# Altium project class-sensor.PrjPcb (part 1 of 2)
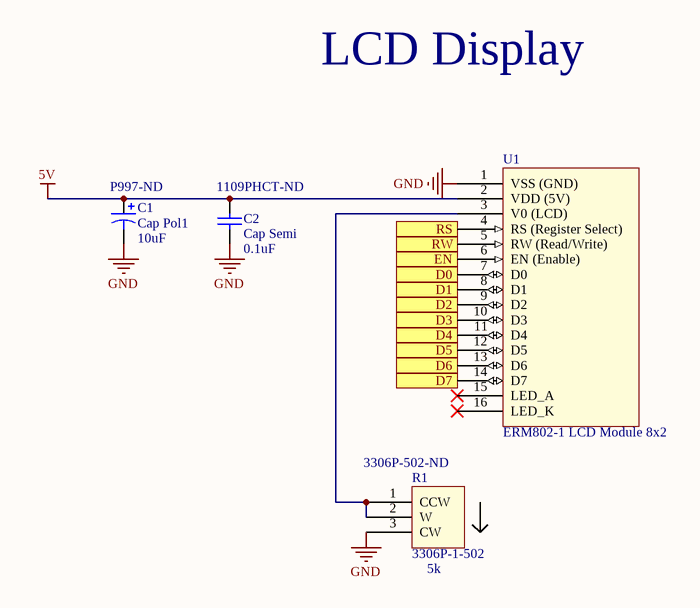
[diagram p0: sensor-1.SchDoc]
6 sheets, 52 parts. Net scope: global (net labels, ports and power ports of the same name join across sheets).
Board file: class-sensor.PcbDoc
Sheets:
  sensor-1.SchDoc
  sensor-2.SchDoc
  sensor-3.SchDoc
  sensor-4.SchDoc
  sensor-5.SchDoc
  sensor-6.SchDoc

## Sheet sensor-1.SchDoc
size Letter

### Parts
C1  Cap Pol1  value 10uF  Supplier Part Number 1: P997-ND  [ECE-A1HKS100]
C2  Cap Semi  value 0.1uF  Supplier Part Number 1: 1109PHCT-ND  [A104K15X7RF5TAA]
R1  3306P-1-502  Supplier Part Number 1: 3306P-502-ND  [3306P-1-502]
U1  ERM802-1 LCD Module 8x2  [ERM802-1]

### Ports
D0, D1, D2, D3, D4, D5, D6, D7, EN, RS, RW

### Nets
5V: C1.1 C2.2 U1.2(VDD_(5V))
GND: C1.2 C2.1 R1.3(CW) U1.1(VSS_(GND))
NetR1_1: R1.1(CCW) R1.2(W) U1.3(V0_(LCD))
NetU1_4: U1.4(RS_(Register_Select)) ; port RS
NetU1_5: U1.5(RW_(Read/Write)) ; port RW
NetU1_6: U1.6(EN_(Enable)) ; port EN
NetU1_7: U1.7(D0) ; port D0
NetU1_8: U1.8(D1) ; port D1
NetU1_9: U1.9(D2) ; port D2
NetU1_10: U1.10(D3) ; port D3
NetU1_11: U1.11(D4) ; port D4
NetU1_12: U1.12(D5) ; port D5
NetU1_13: U1.13(D6) ; port D6
NetU1_14: U1.14(D7) ; port D7

Not connected (* = marked no-connect by the designer): U1 15(LED_A)* 16(LED_K)*

### Notes on the sheet
- LCD Display
- (near R1) 5k

### Library data of the parts
C1 = Cap Pol1: Polarized Capacitor (Radial); Manufacturer: Panasonic; Ripple Current: 35mA; Tolerance: 20%; Voltage Rating: 50V; Polarity: Polar; Life (Hours): 1000Hour; Leakage Current: 3A; Lead Diameter: 0.45mm; Published: 8-Jun-2000; LatestRevisionDate: 17-Jul-2002; LatestRevisionNote: Re-released for DXP Platform.; PackageReference: RB7.6-15; Publisher: Altium Limited; PackageDescription: Polarized Capacitor (Radial); 2 Leads; Supplier 1: Digi-Key; Manufacturer Part Number: ECE-A1HKS100; Stock 1: 132836; Pricing 1: 1=0.10000, 10=0.03000 (USD); RoHS: Yes; Mount: Through Hole,PCB; Case/Package: Radial; Number of Pins: 2; Weight: 0.01lb; Min Operating Temperature: -40°C; Max Operating Temperature: 85°C; Package Quantity: 200; Capacitance: 10uF; Packaging: Bulk; Voltage Rating (DC): 50V; Ripple Current (AC): 35mA; Termination: Radial; Voltage: 50V; Diameter: 6.3mm; Length: 5mm; Height: 5mm; Lead Pitch: 2.5mm; Width: 0.5inch; Height - Seated (Max): 0.197inch; Radiation Hardening: No; Lead Free: Lead Free; REACH SVHC: No SVHC; ComponentLink1URL: https://datasheet.ciiva.com/11778/0900766b800274c4-11778985.pdf?src-supplier=RSComponents; ComponentLink1Description: https://datasheet.ciiva.com/11778/0900766b800274c4-11778985.pdf?src-supplier=RSComponents; ComponentLink2URL: https://datasheet.ciiva.com/17536/aba0000ce15-17536597.pdf?src-supplier=Avnet+Europe; ComponentLink2Description: https://datasheet.ciiva.com/17536/aba0000ce15-17536597.pdf?src-supplier=Avnet+Europe; ComponentLink3URL: https://datasheet.ciiva.com/14594/70067878-14594328.pdf?src-supplier=Allied+Electronics; ComponentLink3Description: https://datasheet.ciiva.com/14594/70067878-14594328.pdf?src-supplier=Allied+Electronics; ComponentLink4URL: https://datasheet.ciiva.com/16205/aba0000ce15-16205737.pdf?src-supplier=Future+Electronics; ComponentLink4Description: https://datasheet.ciiva.com/16205/aba0000ce15-16205737.pdf?src-supplier=Future+Electronics; ComponentLink5URL: https://datasheet.ciiva.com/24025/a-e-461514-24025641.pdf?src-supplier=Mouser; ComponentLink5Description: https://datasheet.ciiva.com/24025/a-e-461514-24025641.pdf?src-supplier=Mouser; ComponentLink6URL: https://datasheet.ciiva.com/43459/1339471-43459545.pdf?src-supplier=Farnell; ComponentLink6Description: https://datasheet.ciiva.com/43459/1339471-43459545.pdf?src-supplier=Farnell; ComponentLink7URL: https://datasheet.ciiva.com/15166/getdatasheetpartid-169217-15166123.pdf?src-supplier=Verical; ComponentLink7Description: https://datasheet.ciiva.com/15166/getdatasheetpartid-169217-15166123.pdf?src-supplier=Verical; ComponentLink8URL: https://datasheet.ciiva.com/46397/1339471-46397117.pdf?src-supplier=Element14; ComponentLink8Description: https://datasheet.ciiva.com/46397/1339471-46397117.pdf?src-supplier=Element14; ComponentLink9URL: https://datasheet.ciiva.com/2983/aba0000ce15-2983886.pdf?src-supplier=Avnet; ComponentLink9Description: https://datasheet.ciiva.com/2983/aba0000ce15-2983886.pdf?src-supplier=Avnet
C2 = Cap Semi: Capacitor (Semiconductor SIM Model); Manufacturer: Vishay BCcomponents; Capacitance: 100nF; Voltage Rating: 50V; Tolerance: 10%; Dielectric: X7R; Lead Length: 24.3mm; Lead Diameter: 0.5mm; Published: 8-Jun-2000; LatestRevisionDate: 29-May-2009; LatestRevisionNote: IPC-7351 Footprint Added.; PackageReference: C1206; Publisher: Altium Limited; PackageDescription: Chip Capacitor; Supplier 1: Digi-Key; Manufacturer Part Number: A104K15X7RF5TAA; Stock 1: 502711; Pricing 1: 1=0.24000, 10=0.16500, 100=0.09350, 500=0.06598, 1000=0.05773, 2500=0.05498 (USD); RoHS: Yes; Mount: Through Hole,PCB,Axial; Case/Package: Dipped; Contact Plating: Tin; Min Operating Temperature: -55°C; Max Operating Temperature: 125°C; Package Quantity: 1; Packaging: Tape and Reel; Voltage Rating (DC): 50V; Termination: Axial; Voltage: 50V; Diameter: 2.5mm; Length: 3.8mm; Radiation Hardening: No; REACH SVHC: Unknown; Lead Free: Lead Free; ComponentLink1URL: https://datasheet.ciiva.com/145/aseries-145936.pdf?src-supplier=Digi-Key; ComponentLink1Description: https://datasheet.ciiva.com/145/aseries-145936.pdf?src-supplier=Digi-Key; ComponentLink2URL: https://datasheet.ciiva.com/5815/1734588-5815375.pdf?src-supplier=Farnell; ComponentLink2Description: https://datasheet.ciiva.com/5815/1734588-5815375.pdf?src-supplier=Farnell; ComponentLink3URL: https://datasheet.ciiva.com/18442/70122957-18442089.pdf?src-supplier=Allied+Electronics; ComponentLink3Description: https://datasheet.ciiva.com/18442/70122957-18442089.pdf?src-supplier=Allied+Electronics; ComponentLink4URL: https://datasheet.ciiva.com/2988/aseries-2988250.pdf?src-supplier=Avnet; ComponentLink4Description: https://datasheet.ciiva.com/2988/aseries-2988250.pdf?src-supplier=Avnet; ComponentLink5URL: https://datasheet.ciiva.com/17444/aseries-17444908.pdf?src-supplier=Avnet+Europe; ComponentLink5Description: https://datasheet.ciiva.com/17444/aseries-17444908.pdf?src-supplier=Avnet+Europe; ComponentLink6URL: https://datasheet.ciiva.com/46418/1796772-46418252.pdf?src-supplier=Element14; ComponentLink6Description: https://datasheet.ciiva.com/46418/1796772-46418252.pdf?src-supplier=Element14; ComponentLink7URL: https://datasheet.ciiva.com/145/aseries-145935.pdf?src-supplier=Digi-Key; ComponentLink7Description: https://datasheet.ciiva.com/145/aseries-145935.pdf?src-supplier=Digi-Key
R1 = 3306P-1-502: TRIMMER 5K OHM 0.2W PC PIN TOP; Manufacturer: Bourns; Resistance: 5kR; Tolerance: 25%; Power Rating: 200mW; Voltage Rating: 100V; Number of Turns: 1; Temperature Coefficient: 250ppm/°C; Pitch: 2.5mm; Supplier 1: Digi-Key; Manufacturer Part Number: 3306P-1-502; Stock 1: 2392; Pricing 1: 1=0.43000, 10=0.40000, 25=0.36000, 50=0.34800, 100=0.33600, 250=0.31200, 500=0.28800, 1000=0.27000, 5000=0.20400 (USD); RoHS: Yes; Mount: Through Hole,PCB; Weight: 360mg; Color: Blue; Contact Plating: Tin; Min Operating Temperature: -25°C; Max Operating Temperature: 100°C; Packaging: Bulk; Package Quantity: 200; Composition: Cermet; Termination: Pin; Taper: Linear; Military Standard: Not; Max Power Dissipation: 200mW; Diameter: 6.81mm; Length: 6.81mm; Height: 7.62mm; Width: 6.81mm; Depth: 8.1mm; Radiation Hardening: No; REACH SVHC: No SVHC; Lead Free: Lead Free; ComponentLink1URL: https://datasheet.ciiva.com/19466/769961-19466616.pdf?src-supplier=Jameco; ComponentLink1Description: https://datasheet.ciiva.com/19466/769961-19466616.pdf?src-supplier=Jameco; ComponentLink2URL: https://datasheet.ciiva.com/11830/0900766b80dbb841-11830858.pdf?src-supplier=RSComponents; ComponentLink2Description: https://datasheet.ciiva.com/11830/0900766b80dbb841-11830858.pdf?src-supplier=RSComponents; ComponentLink3URL: https://datasheet.ciiva.com/29122/447317-da-01-en-trimmer-tht3306p-1-502-5k-0-2w-29122254.pdf?src-supplier=Conrad; ComponentLink3Description: https://datasheet.ciiva.com/29122/447317-da-01-en-trimmer-tht3306p-1-502-5k-0-2w-29122254.pdf?src-supplier=Conrad; ComponentLink4URL: https://datasheet.ciiva.com/2160/3306-2160165.pdf?src-supplier=Digi-Key; ComponentLink4Description: https://datasheet.ciiva.com/2160/3306-2160165.pdf?src-supplier=Digi-Key; ComponentLink5URL: https://datasheet.ciiva.com/20163/67-0600-20163929.pdf?src-supplier=Rapid+Electronics; ComponentLink5Description: https://datasheet.ciiva.com/20163/67-0600-20163929.pdf?src-supplier=Rapid+Electronics; ComponentLink6URL: https://datasheet.ciiva.com/16715/70154382-16715498.pdf?src-supplier=Allied+Electronics; ComponentLink6Description: https://datasheet.ciiva.com/16715/70154382-16715498.pdf?src-supplier=Allied+Electronics; ComponentLink7URL: https://datasheet.ciiva.com/15157/getdatasheetpartid-379572-15157051.pdf?src-supplier=Verical; ComponentLink7Description: https://datasheet.ciiva.com/15157/getdatasheetpartid-379572-15157051.pdf?src-supplier=Verical; ComponentLink8URL: https://datasheet.ciiva.com/1477/1815113-1477453.pdf?src-supplier=Element14; ComponentLink8Description: https://datasheet.ciiva.com/1477/1815113-1477453.pdf?src-supplier=Element14
U1 = ERM802-1

## Sheet sensor-2.SchDoc
size Letter
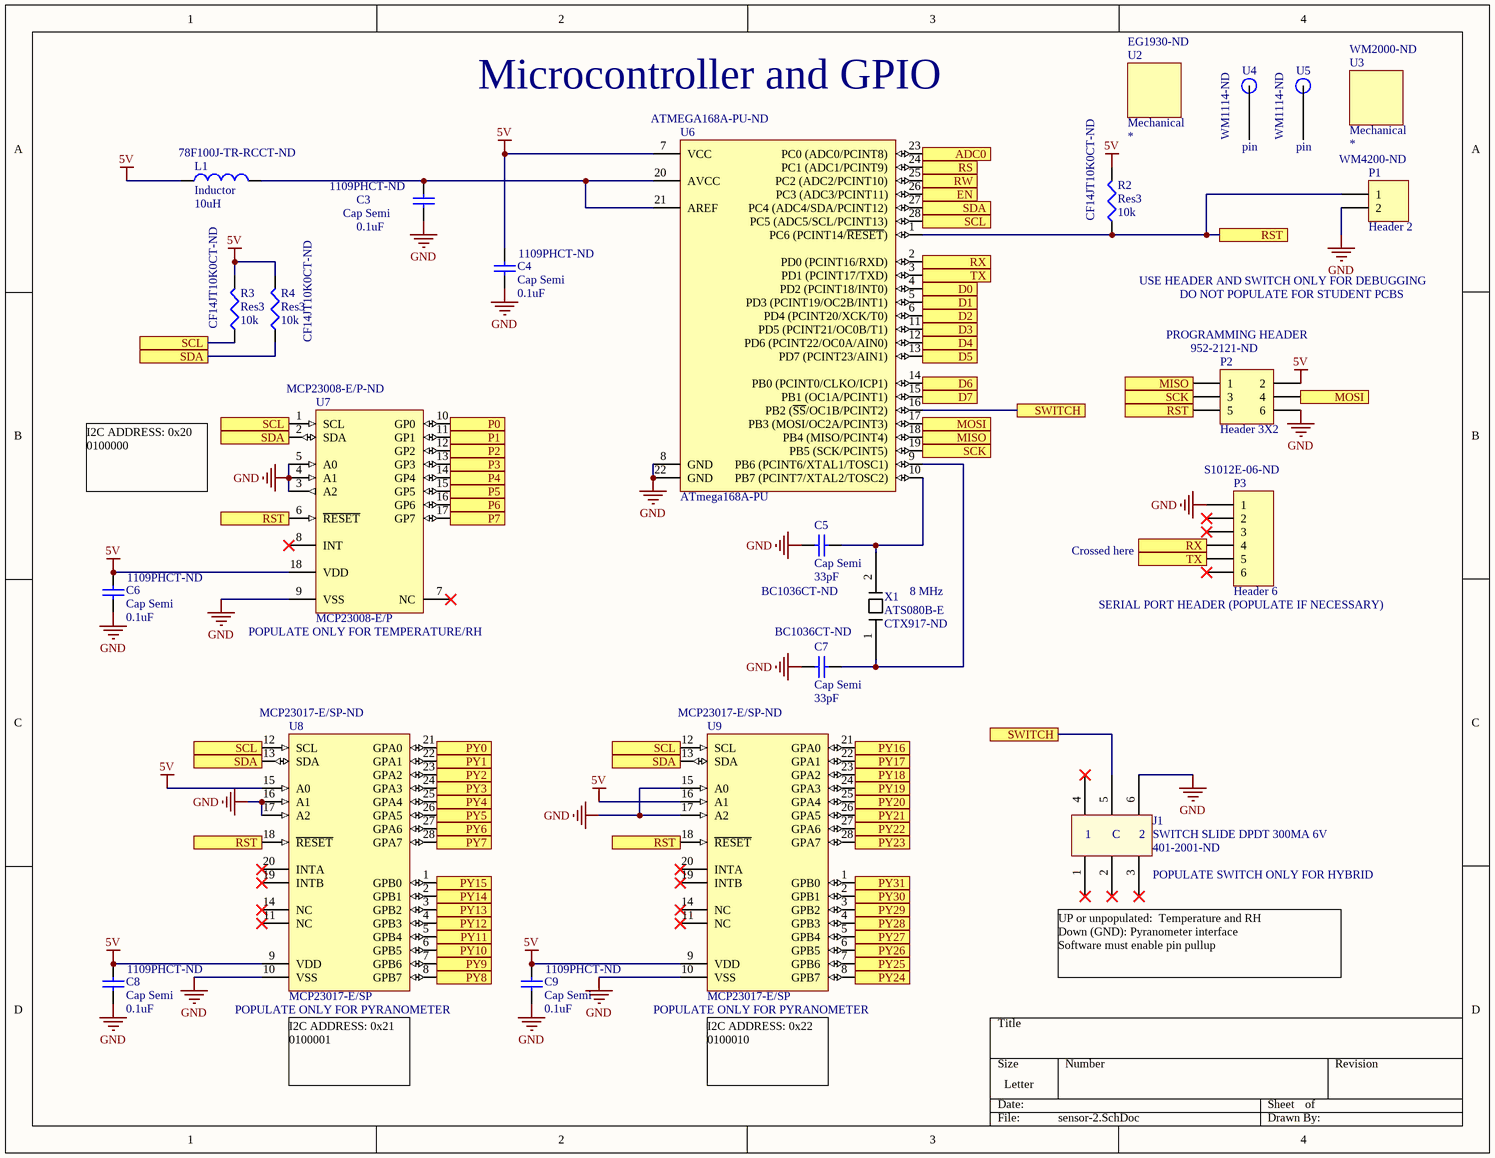
[diagram p1: sensor-2.SchDoc]

### Parts
C3  Cap Semi  value 0.1uF  Supplier Part Number 1: 1109PHCT-ND  [A104K15X7RF5TAA]
C4  Cap Semi  value 0.1uF  Supplier Part Number 1: 1109PHCT-ND  [A104K15X7RF5TAA]
C5  Cap Semi  value 33pF  Supplier Part Number 1: BC1036CT-ND  [K330J15C0GF5TH5]
C6  Cap Semi  value 0.1uF  Supplier Part Number 1: 1109PHCT-ND  [A104K15X7RF5TAA]
C7  Cap Semi  value 33pF  Supplier Part Number 1: BC1036CT-ND  [K330J15C0GF5TH5]
C8  Cap Semi  value 0.1uF  Supplier Part Number 1: 1109PHCT-ND  [A104K15X7RF5TAA]
C9  Cap Semi  value 0.1uF  Supplier Part Number 1: 1109PHCT-ND  [A104K15X7RF5TAA]
J1  SWITCH SLIDE DPDT 300MA 6V  Supplier Part Number 1: 401-2001-ND  [JS202011CQN]
L1  Inductor  value 10uH  Supplier Part Number 1: 78F100J-TR-RCCT-ND  [78F100J-TR-RC]
P1  Header 2  Supplier Part Number 1: WM4200-ND  [HDR1X2]
P2  Header 3X2  Supplier Part Number 1: 952-2121-ND  [HDR2X3]
P3  Header 6  Supplier Part Number 1: S1012E-06-ND  [HDR1X6]
R2  Res3  value 10k  Supplier Part Number 1: CF14JT10K0CT-ND  [CF14JT10K0]
R3  Res3  value 10k  Supplier Part Number 1: CF14JT10K0CT-ND  [CF14JT10K0]
R4  Res3  value 10k  Supplier Part Number 1: CF14JT10K0CT-ND  [CF14JT10K0]
U2  Mechanical  Supplier Part Number 2: EG1930-ND  (mechanical)
U3  Mechanical  Supplier Part Number 2: WM2000-ND  (mechanical)
U4  pin  Supplier Part Number 1: WM1114-ND  (mechanical)
U5  pin  Supplier Part Number 1: WM1114-ND  (mechanical)
U6  ATmega168A-PU  Supplier Part Number 1: ATMEGA168A-PU-ND  [28P3]
U7  MCP23008-E/P  Supplier Part Number 1: MCP23008-E/P-ND  [PDIP300-P18]
U8  MCP23017-E/SP  Supplier Part Number 1: MCP23017-E/SP-ND  [SPDIP300-SP28]
U9  MCP23017-E/SP  Supplier Part Number 1: MCP23017-E/SP-ND  [SPDIP300-SP28]
X1  ATS080B-E  Supplier Part Number 1: CTX917-ND  [ATS080B-E]

### Ports
ADC0, D0, D1, D2, D3, D4, D5, D6, D7, EN, MISO, MOSI, P0, P1, P2, P3, P4, P5, P6, P7, PY0, PY1, PY2, PY3, PY4, PY5, PY6, PY7, PY8, PY9, PY10, PY11, PY12, PY13, PY14, PY15, PY16, PY17, PY18, PY19, PY20, PY21, PY22, PY23, PY24, PY25, PY26, PY27, PY28, PY29, PY30, PY31, RS, RST, RW, RX, SCK, SCL, SDA, SWITCH, TX

### Nets
5V: C4.2 C6.2 C8.2 C9.2 L1.1 P2.2 R2.2 R3.2 R4.2 U6.7(VCC) U7.18(VDD) U8.9(VDD) U8.15(A0) U9.9(VDD) U9.16(A1)
GND: C3.1 C4.1 C5.1 C6.1 C7.1 C8.1 C9.1 J1.6 P1.2 P2.6 P3.1 U6.8(GND) U6.22(GND) U7.3(A2) U7.4(A1) U7.5(A0) U7.9(VSS) U8.10(VSS) U8.16(A1) U8.17(A2) U9.10(VSS) U9.15(A0) U9.17(A2)
NetC3_2: C3.2 L1.2 U6.20(AVCC) U6.21(AREF)
NetC5_2: C5.2 U6.10(PB7_(PCINT7/XTAL2/TOSC2)) X1.2
NetC7_2: C7.2 U6.9(PB6_(PCINT6/XTAL1/TOSC1)) X1.1
NetD4_2: U6.23(PC0_(ADC0/PCINT8)) ; port ADC0
NetJ1_5: J1.5 U6.16(PB2_(~{SS}/OC1B/PCINT2)) ; port SWITCH
NetP1_1: P1.1 P2.5 R2.1 U6.1(PC6_(PCINT14/~{RESET})) U7.6(~{RESET}) U8.18(~{RESET}) U9.18(~{RESET}) ; port RST
NetP2_1: P2.1 U6.18(PB4_(MISO/PCINT4)) ; port MISO
NetP2_3: P2.3 U6.19(PB5_(SCK/PCINT5)) ; port SCK
NetP2_4: P2.4 U6.17(PB3_(MOSI/OC2A/PCINT3)) ; port MOSI
NetP3_4: P3.4 U6.2(PD0_(PCINT16/RXD)) ; port RX
NetP3_5: P3.5 U6.3(PD1_(PCINT17/TXD)) ; port TX
NetP4_1: U8.21(GPA0) ; port PY0
NetP4_3: U8.22(GPA1) ; port PY1
NetP4_5: U8.23(GPA2) ; port PY2
NetP4_7: U8.24(GPA3) ; port PY3
NetP4_9: U8.25(GPA4) ; port PY4
NetP4_11: U8.26(GPA5) ; port PY5
NetP4_13: U8.27(GPA6) ; port PY6
NetP4_15: U8.28(GPA7) ; port PY7
NetP4_17: U8.8(GPB7) ; port PY8
NetP4_19: U8.7(GPB6) ; port PY9
NetP4_21: U8.6(GPB5) ; port PY10
NetP4_23: U8.5(GPB4) ; port PY11
NetP4_25: U8.4(GPB3) ; port PY12
NetP4_27: U8.3(GPB2) ; port PY13
NetP4_29: U8.2(GPB1) ; port PY14
NetP4_31: U8.1(GPB0) ; port PY15
NetP5_1: U7.10(GP0) ; port P0
NetP5_3: U7.11(GP1) ; port P1
NetP5_5: U7.12(GP2) ; port P2
NetP5_7: U7.13(GP3) ; port P3
NetP5_9: U7.14(GP4) ; port P4
NetP5_11: U7.15(GP5) ; port P5
NetP5_13: U7.16(GP6) ; port P6
NetP5_15: U7.17(GP7) ; port P7
NetP6_1: U9.21(GPA0) ; port PY16
NetP6_3: U9.22(GPA1) ; port PY17
NetP6_5: U9.23(GPA2) ; port PY18
NetP6_7: U9.24(GPA3) ; port PY19
NetP6_9: U9.25(GPA4) ; port PY20
NetP6_11: U9.26(GPA5) ; port PY21
NetP6_13: U9.27(GPA6) ; port PY22
NetP6_15: U9.28(GPA7) ; port PY23
NetP6_17: U9.8(GPB7) ; port PY24
NetP6_19: U9.7(GPB6) ; port PY25
NetP6_21: U9.6(GPB5) ; port PY26
NetP6_23: U9.5(GPB4) ; port PY27
NetP6_25: U9.4(GPB3) ; port PY28
NetP6_27: U9.3(GPB2) ; port PY29
NetP6_29: U9.2(GPB1) ; port PY30
NetP6_31: U9.1(GPB0) ; port PY31
NetR3_1: R3.1 U6.28(PC5_(ADC5/SCL/PCINT13)) U7.1(SCL) U8.12(SCL) U9.12(SCL) ; port SCL
NetR4_1: R4.1 U6.27(PC4_(ADC4/SDA/PCINT12)) U7.2(SDA) U8.13(SDA) U9.13(SDA) ; port SDA
NetU1_4: U6.24(PC1_(ADC1/PCINT9)) ; port RS
NetU1_5: U6.25(PC2_(ADC2/PCINT10)) ; port RW
NetU1_6: U6.26(PC3_(ADC3/PCINT11)) ; port EN
NetU1_7: U6.4(PD2_(PCINT18/INT0)) ; port D0
NetU1_8: U6.5(PD3_(PCINT19/OC2B/INT1)) ; port D1
NetU1_9: U6.6(PD4_(PCINT20/XCK/T0)) ; port D2
NetU1_10: U6.11(PD5_(PCINT21/OC0B/T1)) ; port D3
NetU1_11: U6.12(PD6_(PCINT22/OC0A/AIN0)) ; port D4
NetU1_12: U6.13(PD7_(PCINT23/AIN1)) ; port D5
NetU1_13: U6.14(PB0_(PCINT0/CLKO/ICP1)) ; port D6
NetU1_14: U6.15(PB1_(OC1A/PCINT1)) ; port D7

Not connected (* = marked no-connect by the designer): J1 1* 2* 3* 4*; P3 2* 3* 6*; U7 7(NC)* 8(INT)*; U8 11(NC)* 14(NC)* 19(INTB)* 20(INTA)*; U9 11(NC)* 14(NC)* 19(INTB)* 20(INTA)*

### Notes on the sheet
- Microcontroller and GPIO
- USE HEADER AND SWITCH ONLY FOR DEBUGGING
- DO NOT POPULATE FOR STUDENT PCBS
- (near P2) PROGRAMMING HEADER
- I2C ADDRESS: 0x20
  0100000
- Crossed here
- (near U7) POPULATE ONLY FOR TEMPERATURE/RH
- (near X1) 8 MHz
- (near P3) SERIAL PORT HEADER (POPULATE IF NECESSARY)
- (near J1) POPULATE SWITCH ONLY FOR HYBRID
- UP or unpopulated:  Temperature and RH
  Down (GND): Pyranometer interface
  Software must enable pin pullup
- (near U8) POPULATE ONLY FOR PYRANOMETER
- (near U9) POPULATE ONLY FOR PYRANOMETER
- (near U8) I2C ADDRESS: 0x21
  0100001
- (near U9) I2C ADDRESS: 0x22
  0100010
- (in symbol JS202011CQN) C

### Library data of the parts
C3 C4 C6 C8 C9 = Cap Semi: as C2 on sheet sensor-1; Published: 8-Jun-2000; LatestRevisionDate: 29-May-2009; LatestRevisionNote: IPC-7351 Footprint Added.; PackageReference: C1206; Publisher: Altium Limited; PackageDescription: Chip Capacitor; Supplier 1: Digi-Key; Manufacturer Part Number: A104K15X7RF5TAA; Stock 1: 502711; Pricing 1: 1=0.24000, 10=0.16500, 100=0.09350, 500=0.06598, 1000=0.05773, 2500=0.05498 (USD); RoHS: Yes; Mount: Through Hole,PCB,Axial; Case/Package: Dipped; Contact Plating: Tin; Min Operating Temperature: -55°C; Max Operating Temperature: 125°C; Package Quantity: 1; Packaging: Tape and Reel; Voltage Rating (DC): 50V; Termination: Axial; Voltage: 50V; Diameter: 2.5mm; Length: 3.8mm; Radiation Hardening: No; REACH SVHC: Unknown; Lead Free: Lead Free; ComponentLink1URL: https://datasheet.ciiva.com/145/aseries-145936.pdf?src-supplier=Digi-Key; ComponentLink1Description: https://datasheet.ciiva.com/145/aseries-145936.pdf?src-supplier=Digi-Key; ComponentLink2URL: https://datasheet.ciiva.com/5815/1734588-5815375.pdf?src-supplier=Farnell; ComponentLink2Description: https://datasheet.ciiva.com/5815/1734588-5815375.pdf?src-supplier=Farnell; ComponentLink3URL: https://datasheet.ciiva.com/18442/70122957-18442089.pdf?src-supplier=Allied+Electronics; ComponentLink3Description: https://datasheet.ciiva.com/18442/70122957-18442089.pdf?src-supplier=Allied+Electronics; ComponentLink4URL: https://datasheet.ciiva.com/2988/aseries-2988250.pdf?src-supplier=Avnet; ComponentLink4Description: https://datasheet.ciiva.com/2988/aseries-2988250.pdf?src-supplier=Avnet; ComponentLink5URL: https://datasheet.ciiva.com/17444/aseries-17444908.pdf?src-supplier=Avnet+Europe; ComponentLink5Description: https://datasheet.ciiva.com/17444/aseries-17444908.pdf?src-supplier=Avnet+Europe; ComponentLink6URL: https://datasheet.ciiva.com/46418/1796772-46418252.pdf?src-supplier=Element14; ComponentLink6Description: https://datasheet.ciiva.com/46418/1796772-46418252.pdf?src-supplier=Element14; ComponentLink7URL: https://datasheet.ciiva.com/145/aseries-145935.pdf?src-supplier=Digi-Key; ComponentLink7Description: https://datasheet.ciiva.com/145/aseries-145935.pdf?src-supplier=Digi-Key
C5 C7 = Cap Semi: Capacitor (Semiconductor SIM Model); Manufacturer: Vishay BCcomponents; Dielectric Material: Ceramic; Tolerance: 5%; Voltage Rating: 50V; Dielectric: C0G; Lead/Base Style: Formed Leads; Lead Length: 30mm; Published: 8-Jun-2000; LatestRevisionDate: 29-May-2009; LatestRevisionNote: IPC-7351 Footprint Added.; PackageReference: C1206; Publisher: Altium Limited; PackageDescription: Chip Capacitor; Supplier 1: Digi-Key; Manufacturer Part Number: K330J15C0GF5TH5; Stock 1: 19591; Pricing 1: 1=0.26000, 10=0.17400, 100=0.08830, 500=0.06040, 1000=0.05343 (USD); RoHS: Yes; Mount: Through Hole; Case/Package: Dipped; Number of Pins: 2; Min Operating Temperature: -55°C; Max Operating Temperature: 125°C; Capacitance: 33pF; Packaging: Tape and Reel; Package Quantity: 1; Termination: Radial; Voltage Rating (DC): 50V; Length: 0.157inch; Width: 0.098inch; Lead Pitch: 5mm; Height - Seated (Max): 0.257inch; Depth: 2.5mm; Radiation Hardening: No; REACH SVHC: Unknown; Lead Free: Contains Lead; ComponentLink1URL: https://datasheet.ciiva.com/145/kseries-145772.pdf?src-supplier=Digi-Key; ComponentLink1Description: https://datasheet.ciiva.com/145/kseries-145772.pdf?src-supplier=Digi-Key; ComponentLink2URL: https://datasheet.ciiva.com/145/kseries-145773.pdf?src-supplier=Digi-Key; ComponentLink2Description: https://datasheet.ciiva.com/145/kseries-145773.pdf?src-supplier=Digi-Key
J1 = JS202011CQN: Manufacturer: ITT C&K; Actuator Material: Nylon,Polyamide; Electrical Life: 5000Cycles; Switch Function: On-On; Illumination Type: Non-Illuminated; Contact Current Rating: 100mA; Contact Resistance: 70mR; Switch Travel: 2mm; Actuator Type: Standard; Supplier 1: Digi-Key; Manufacturer Part Number: JS202011CQN; Stock 1: 30365; Pricing 1: 1=0.43000, 10=0.41600, 25=0.40720, 50=0.36380, 100=0.34650, 250=0.33784, 500=0.28586, 1000=0.27720, 5000=0.24255 (USD); RoHS: Yes; Mount: Through Hole; Contact Plating: Silver; Contact Material: Copper Alloy; Housing Material: Nylon; Min Operating Temperature: -40°C; Max Operating Temperature: 85°C; Package Quantity: 1; Packaging: Bulk; Termination: PC Pins; Voltage Rating (DC): 6V; Throw Configuration: DPDT; Current Rating: 300mA; Max Voltage Rating (DC): 6V; Max Current Rating: 300mA; Orientation: Vertical; Length: 9mm; Actuator Length: 2mm; Depth: 3.6mm; Radiation Hardening: No; Lead Free: Lead Free; REACH SVHC: No SVHC; Flammability Rating: UL94 V-0; ComponentLink1URL: https://datasheet.ciiva.com/5280/js-15sept15-5280375.pdf?src-supplier=Mouser; ComponentLink1Description: https://datasheet.ciiva.com/5280/js-15sept15-5280375.pdf?src-supplier=Mouser; ComponentLink2URL: https://datasheet.ciiva.com/22630/1707718-22630695.pdf?src-supplier=Element14; ComponentLink2Description: https://datasheet.ciiva.com/22630/1707718-22630695.pdf?src-supplier=Element14; ComponentLink3URL: https://datasheet.ciiva.com/8082/js-9dec14-8082522.pdf?src-supplier=Avnet; ComponentLink3Description: https://datasheet.ciiva.com/8082/js-9dec14-8082522.pdf?src-supplier=Avnet; ComponentLink4URL: https://datasheet.ciiva.com/2889/js-9dec14-2889166.pdf?src-supplier=Digi-Key; ComponentLink4Description: https://datasheet.ciiva.com/2889/js-9dec14-2889166.pdf?src-supplier=Digi-Key
L1 = Inductor: Manufacturer: Bourns; Code_IEC: 1005; Core Material: Ferrite; Tolerance: 5%; Self Resonant Frequency: 18MHz; Shielding: Unshielded; Current Rating: 370mA; DC Resistance (DCR): 750mR; Test Frequency: 7.9MHz; Q Factor: 40; Lead/Base Style: Axial; Lead Diameter: 0.51mm; Published: 8-Jun-2000; LatestRevisionDate: 29-May-2009; LatestRevisionNote: IPC-7351 Footprint Added.; PackageReference: 0402-A; Publisher: Altium Limited; PackageDescription: Chip Inductor; Code_JEITA: 0402; Supplier 1: Digi-Key; Manufacturer Part Number: 78F100J-TR-RC; Stock 1: 122934; Pricing 1: 1=0.31000, 10=0.27600, 100=0.18980, 500=0.16216, 1000=0.12420, 2500=0.11730 (USD); RoHS: Yes; Mount: Through Hole; Case/Package: Axial; Contact Plating: Tin; Min Operating Temperature: -55°C; Max Operating Temperature: 105°C; Packaging: Tape and Reel; Package Quantity: 5000; Composition: Wirewound; Inductance: 10uH; Max DC Current: 370mA; Termination: Axial; DC Current: 370mA; Military Standard: Not; Diameter: 2.79mm; Length: 7.11mm; Radiation Hardening: No; ComponentLink1URL: https://datasheet.ciiva.com/15161/getdatasheetpartid-486343-15161381.pdf?src-supplier=Verical; ComponentLink1Description: https://datasheet.ciiva.com/15161/getdatasheetpartid-486343-15161381.pdf?src-supplier=Verical; ComponentLink2URL: https://datasheet.ciiva.com/6703/78f-series-6703431.pdf?src-supplier=Digi-Key; ComponentLink2Description: https://datasheet.ciiva.com/6703/78f-series-6703431.pdf?src-supplier=Digi-Key
P1 = Header 2: Header, 2-Pin; Manufacturer: Molex; Number of Positions: 2; Gender: Male; Contact Resistance: 10mR; Max Current Rating: 4A; Voltage Rating: 250V; Insulation Resistance: 500GR; Pitch: 2.54mm; Approvals: UL,CSA; Glow Wire Compliant: Non-compliant; LatestRevisionDate: 17-Jul-2002; LatestRevisionNote: Re-released for DXP Platform.; Publisher: Altium Limited; Supplier 1: Digi-Key; Manufacturer Part Number: 22-23-2021; Stock 1: 25623; Pricing 1: 1=0.17000, 10=0.16100, 100=0.11150, 500=0.09438, 1000=0.07722, 5000=0.06864, 10000=0.06221 (USD); RoHS: Yes; Mount: Through Hole; Color: White; Housing Color: White; Housing Material: Nylon; Contact Plating: Tin,Copper; Contact Material: Brass; Min Operating Temperature: 0°C; Max Operating Temperature: 75°C; Package Quantity: 3000; Number of Rows: 1; Packaging: Bulk; Termination: Through Hole; Number of Contacts: 2; Orientation: Straight; Current Rating: 4A; Voltage Rating (DC): 250V; Number of Circuits: 2; Length: 5.08mm; Height: 10.67mm; Depth: 6.35mm; Radiation Hardening: No; REACH SVHC: Unknown; Halogen Free: Low Halogen; Lead Free: Lead Free; Flammability Rating: UL94 V-0; ComponentLink1URL: https://datasheet.ciiva.com/19454/232266-19454304.pdf?src-supplier=Jameco; ComponentLink1Description: https://datasheet.ciiva.com/19454/232266-19454304.pdf?src-supplier=Jameco; ComponentLink2URL: https://datasheet.ciiva.com/5150/0022232021-pcb-headers-227096-5150681.pdf?src-supplier=Mouser; ComponentLink2Description: https://datasheet.ciiva.com/5150/0022232021-pcb-headers-227096-5150681.pdf?src-supplier=Mouser; ComponentLink3URL: https://datasheet.ciiva.com/22683/1834442-22683561.pdf?src-supplier=Element14; ComponentLink3Description: https://datasheet.ciiva.com/22683/1834442-22683561.pdf?src-supplier=Element14; ComponentLink4URL: https://datasheet.ciiva.com/11746/0900766b80d8f4d1-11746058.pdf?src-supplier=RSComponents; ComponentLink4Description: https://datasheet.ciiva.com/11746/0900766b80d8f4d1-11746058.pdf?src-supplier=RSComponents; ComponentLink5URL: https://datasheet.ciiva.com/30253/114200022232021-pcb-headers-30253002.pdf?src-supplier=Onlinecomponents.com; ComponentLink5Description: https://datasheet.ciiva.com/30253/114200022232021-pcb-headers-30253002.pdf?src-supplier=Onlinecomponents.com; ComponentLink6URL: https://datasheet.ciiva.com/9468/0022232021-pcb-headers-9468476.pdf?src-supplier=Avnet; ComponentLink6Description: https://datasheet.ciiva.com/9468/0022232021-pcb-headers-9468476.pdf?src-supplier=Avnet; ComponentLink7URL: https://datasheet.ciiva.com/18453/70190606-18453638.pdf?src-supplier=Allied+Electronics; ComponentLink7Description: https://datasheet.ciiva.com/18453/70190606-18453638.pdf?src-supplier=Allied+Electronics; ComponentLink8URL: https://datasheet.ciiva.com/16658/0022232021-pcb-headers-16658167.pdf?src-supplier=Avnet+Europe; ComponentLink8Description: https://datasheet.ciiva.com/16658/0022232021-pcb-headers-16658167.pdf?src-supplier=Avnet+Europe
P2 = Header 3X2: Header, 3-Pin, Dual row; Manufacturer: Harwin; Manufacturer Part Number: M20-9980346; Contact Resistance: 25mR; Max Current Rating: 3A; Number of Positions: 6; Gender: Male; Connector Type: Male Pin; Insulation Resistance: 10GR; Pitch: 2.54mm; Row Spacing: 0.1inch; LatestRevisionDate: 17-Jul-2002; LatestRevisionNote: Re-released for DXP Platform.; Publisher: Altium Limited; Supplier 1: Digi-Key; Stock 1: 26462; Pricing 1: 1=0.24000, 10=0.22900, 100=0.15860, 500=0.13420, 1000=0.10980, 5000=0.09760, 10000=0.08845 (USD); RoHS: Yes; Mount: Through Hole; Color: Black; Contact Material: Bronze,Brass; Housing Color: Black; Housing Material: Nylon; Contact Plating: Tin; Min Operating Temperature: -40°C; Max Operating Temperature: 105°C; Package Quantity: 1000; Packaging: Bag; Termination: Solder; Number of Rows: 2; Number of Contacts: 6; Orientation: Straight; Current Rating: 3A; Length: 7.62mm; Depth: 5.08mm; Contact Mating Length: 0.24inch; Radiation Hardening: No; REACH SVHC: No SVHC; ComponentLink1URL: https://datasheet.ciiva.com/26899/getdatasheetpartid-483857-26899433.pdf?src-supplier=Verical; ComponentLink1Description: https://datasheet.ciiva.com/26899/getdatasheetpartid-483857-26899433.pdf?src-supplier=Verical; ComponentLink2URL: https://datasheet.ciiva.com/11745/0900766b81034e61-11745752.pdf?src-supplier=RSComponents; ComponentLink2Description: https://datasheet.ciiva.com/11745/0900766b81034e61-11745752.pdf?src-supplier=RSComponents; ComponentLink3URL: https://datasheet.ciiva.com/8046/112195-8046906.pdf?src-supplier=Element14; ComponentLink3Description: https://datasheet.ciiva.com/8046/112195-8046906.pdf?src-supplier=Element14
P3 = Header 6: Header, 6-Pin; Manufacturer: Sullins; Manufacturer Part Number: PEC06SAAN; Number of Positions: 6; Gender: Male; Connector Type: Male Pin; Pitch: 0.1inch; LatestRevisionDate: 17-Jul-2002; LatestRevisionNote: Re-released for DXP Platform.; Publisher: Altium Limited; Supplier 1: Digi-Key; Stock 1: 33150; Pricing 1: 1=0.41000, 10=0.38500, 25=0.33000, 50=0.28060, 100=0.26950, 250=0.24200, 500=0.23100 (USD); RoHS: Yes; Mount: Through Hole; Color: Black; Contact Plating: Tin; Housing Color: Black; Contact Material: Bronze; Housing Material: Plastic; Package Quantity: 1; Number of Rows: 1; Packaging: Bulk; Termination: Solder; Number of Contacts: 6; Length: 15.2mm; Height: 2.54mm; Contact Mating Length: 0.23inch; Width: 2.54mm; Lead Free: Lead Free; ComponentLink1URL: https://s3.amazonaws.com/catalogspreads-pdf/PAGE112-113%20.100%20MALE%20HDR.pdf?src-supplier=Digi-Key; ComponentLink1Description: https://s3.amazonaws.com/catalogspreads-pdf/PAGE112-113%20.100%20MALE%20HDR.pdf?src-supplier=Digi-Key; ComponentLink2URL: http://www.sullinscorp.com/catalogs/97_Page78-79_HEADER_.100_2.54mm_MALE_BREAKAWAY.pdf?src-supplier=Future+Electronics; ComponentLink2Description: http://www.sullinscorp.com/catalogs/97_Page78-79_HEADER_.100_2.54mm_MALE_BREAKAWAY.pdf?src-supplier=Future+Electronics
R2-R4 = Res3: Resistor; Manufacturer: Stackpole Electronics; Resistance: 10kR; Tolerance: 5%; Power Rating: 250mW; Temperature Coefficient: -500ppm/°C; Published: 8-Jun-2000; LatestRevisionDate: 29-May-2009; LatestRevisionNote: IPC-7351 Footprint Added.; PackageReference: J1-0603; Publisher: Altium Limited; PackageDescription: Chip Resistor; Supplier 1: Digi-Key; Manufacturer Part Number: CF14JT10K0; Stock 1: 858538; Pricing 1: 1=0.10000, 10=0.04000, 25=0.02880, 50=0.02200, 100=0.01620, 250=0.01236, 500=0.00990, 1000=0.00729 (USD); RoHS: Yes; Mount: Through Hole,Axial; Case/Package: Conformal; Contact Plating: Tin,Matte; Min Operating Temperature: -55°C; Max Operating Temperature: 155°C; Packaging: Tape and Reel; Package Quantity: 1; Composition: Carbon Film; Number of Terminations: 2; Military Standard: Not; Termination: Axial; Max Power Dissipation: 250mW; Features: Flame Retardant Coating; Diameter: 2.3mm; Length: 6.5mm; Radiation Hardening: No; Lead Free: Lead Free; ComponentLink1URL: https://www.verical.com/server-webapp/html/getDatasheet?partID=367360&src-supplier=Verical; ComponentLink1Description: https://www.verical.com/server-webapp/html/getDatasheet?partID=367360&src-supplier=Verical; ComponentLink2URL: https://www.seielect.com/catalog/SEI-CF_CFM.pdf?src-supplier=Avnet; ComponentLink2Description: https://www.seielect.com/catalog/SEI-CF_CFM.pdf?src-supplier=Avnet; ComponentLink3URL: http://www.seielect.com/Catalog/SEI-CF_CFM.pdf?src-supplier=Future+Electronics; ComponentLink3Description: http://www.seielect.com/Catalog/SEI-CF_CFM.pdf?src-supplier=Future+Electronics; ComponentLink4URL: https://www.seielect.com/catalog/SEI-Packaging.pdf?src-supplier=Digi-Key; ComponentLink4Description: https://www.seielect.com/catalog/SEI-Packaging.pdf?src-supplier=Digi-Key; ComponentLink5URL: http://components.arrow.com/part/dataview/27619991S9848636N1174?src-supplier=Arrow; ComponentLink5Description: http://components.arrow.com/part/dataview/27619991S9848636N1174?src-supplier=Arrow
U2 = Mechanical part: Manufacturer: E-Switch; Manufacturer Part Number: RP3502ARED; Mechanical Life: 6000Cycles; Current Rating: 3A; Voltage Rating (AC): 120V; Max Voltage Rating (AC): 250V; Throw Configuration: SPST; Contact Resistance: 50mR; Illumination Type: Illuminated; Switch Function: Off-Mom; Actuator Type: Round, Button; Actuator Length: 3mm; Supplier Part Number 1: *; Supplier 2: Digi-Key; Stock 2: 7662; Pricing 2: 1=1.80000, 10=1.68400, 25=1.60400, 50=1.52380, 100=1.48370, 250=1.44360, 500=1.36340, 1000=1.28320, 5000=1.08270 (USD); RoHS: Yes; Mount: Panel,Front; Min Operating Temperature: -20°C; Max Operating Temperature: 65°C; Package Quantity: 1; Packaging: Bulk; Termination: Solder; Electrical Life: 6000Cycles; Orientation: Straight; Contact Current Rating: 3A; Diameter: 14mm; Lead Free: Lead Free; ComponentLink1URL: https://datasheet.ciiva.com/2870/f030012-2870146.pdf?src-supplier=Digi-Key; ComponentLink1Description: https://datasheet.ciiva.com/2870/f030012-2870146.pdf?src-supplier=Digi-Key; ComponentLink2URL: https://datasheet.ciiva.com/5262/f030012-16921-5262232.pdf?src-supplier=Mouser; ComponentLink2Description: https://datasheet.ciiva.com/5262/f030012-16921-5262232.pdf?src-supplier=Mouser; ComponentLink3URL: https://datasheet.ciiva.com/16483/f030012-16483333.pdf?src-supplier=Future+Electronics; ComponentLink3Description: https://datasheet.ciiva.com/16483/f030012-16483333.pdf?src-supplier=Future+Electronics; ComponentLink4URL: https://datasheet.ciiva.com/16192/f030012-16192183.pdf?src-supplier=Onlinecomponents.com; ComponentLink4Description: https://datasheet.ciiva.com/16192/f030012-16192183.pdf?src-supplier=Onlinecomponents.com
U3 = Mechanical part: Manufacturer: Molex; Gender: Female; Connector Type: Socket; Max Current Rating: 4A; Number of Positions: 2; Voltage Rating: 250V; Pitch: 2.54mm; Approvals: UL,CSA; Glow Wire Compliant: Non-compliant; Supplier Part Number 1: *; Supplier 2: Digi-Key; Manufacturer Part Number: 22-01-3027; Stock 2: 100786; Pricing 2: 1=0.13000, 10=0.12000, 25=0.08920, 50=0.07660, 100=0.07400, 250=0.06376, 500=0.06120, 1000=0.05355, 2500=0.04845 (USD); RoHS: Yes; Mount: Cable; Contact Material: Bronze,Brass; Color: White; Housing Color: White; Housing Material: Nylon; Min Operating Temperature: 0°C; Max Operating Temperature: 75°C; Packaging: Bulk; Termination: Crimp; Orientation: Straight; Number of Rows: 1; Number of Contacts: 2; Number of Circuits: 2; Length: 5.64mm; Height: 4.82mm; Depth: 12.7mm; Width: 4.82mm; Radiation Hardening: No; Lead Free: Lead Free; REACH SVHC: Unknown; Halogen Free: Low Halogen; Flammability Rating: UL94 V-0; ComponentLink1URL: https://datasheet.ciiva.com/11740/0900766b812c7f18-11740520.pdf?src-supplier=RSComponents; ComponentLink1Description: https://datasheet.ciiva.com/11740/0900766b812c7f18-11740520.pdf?src-supplier=RSComponents; ComponentLink2URL: https://datasheet.ciiva.com/19454/234798-19454255.pdf?src-supplier=Jameco; ComponentLink2Description: https://datasheet.ciiva.com/19454/234798-19454255.pdf?src-supplier=Jameco; ComponentLink3URL: https://datasheet.ciiva.com/3920/67230022013027-crimp-housings-3920657.pdf?src-supplier=Arrow; ComponentLink3Description: https://datasheet.ciiva.com/3920/67230022013027-crimp-housings-3920657.pdf?src-supplier=Arrow; ComponentLink4URL: https://datasheet.ciiva.com/16126/1039760022013027-crimp-housings-16126180.pdf?src-supplier=Onlinecomponents.com; ComponentLink4Description: https://datasheet.ciiva.com/16126/1039760022013027-crimp-housings-16126180.pdf?src-supplier=Onlinecomponents.com; ComponentLink5URL: https://datasheet.ciiva.com/5158/0022013027-crimp-housings-158305-5158363.pdf?src-supplier=Mouser; ComponentLink5Description: https://datasheet.ciiva.com/5158/0022013027-crimp-housings-158305-5158363.pdf?src-supplier=Mouser; ComponentLink6URL: https://datasheet.ciiva.com/30127/0022013027-crimp-housings-30127230.pdf?src-supplier=Onlinecomponents.com; ComponentLink6Description: https://datasheet.ciiva.com/30127/0022013027-crimp-housings-30127230.pdf?src-supplier=Onlinecomponents.com; ComponentLink7URL: https://datasheet.ciiva.com/19473/1965533-19473786.pdf?src-supplier=Jameco; ComponentLink7Description: https://datasheet.ciiva.com/19473/1965533-19473786.pdf?src-supplier=Jameco; ComponentLink8URL: https://datasheet.ciiva.com/7920/1875697-7920678.pdf?src-supplier=Element14; ComponentLink8Description: https://datasheet.ciiva.com/7920/1875697-7920678.pdf?src-supplier=Element14; ComponentLink9URL: https://datasheet.ciiva.com/16660/0022013027-crimp-housings-16660629.pdf?src-supplier=Avnet+Europe; ComponentLink9Description: https://datasheet.ciiva.com/16660/0022013027-crimp-housings-16660629.pdf?src-supplier=Avnet+Europe; ComponentLink10URL: https://datasheet.ciiva.com/15217/getdatasheetpartid-175294-15217511.pdf?src-supplier=Verical; ComponentLink10Description: https://datasheet.ciiva.com/15217/getdatasheetpartid-175294-15217511.pdf?src-supplier=Verical; ComponentLink11URL: https://datasheet.ciiva.com/10401/0022013027-crimp-housings-10401658.pdf?src-supplier=Avnet; ComponentLink11Description: https://datasheet.ciiva.com/10401/0022013027-crimp-housings-10401658.pdf?src-supplier=Avnet
U4 U5 = pin: Manufacturer: Molex; Manufacturer Part Number: 0008500114; Gender: Female; Contact Resistance: 20mR; Max Current Rating: 4A; Max Voltage Rating (AC): 250V; Shielding: Unshielded; Wire Gauge (Max): 30AWG; Wire Gauge (Min): 22AWG; Supplier 1: Digi-Key; Stock 1: 0; RoHS: Yes; Mount: Cable; Contact Material: Brass; Contact Plating: Tin; Termination: Crimp; Packaging: Bulk; Orientation: Straight; Length: 9.7mm; Depth: 2mm; Wire/Cable Gauge: 30AWG; ComponentLink1URL: https://datasheet.ciiva.com/6806/008550101-sd-6806024.pdf?src-supplier=Digi-Key; ComponentLink1Description: https://datasheet.ciiva.com/6806/008550101-sd-6806024.pdf?src-supplier=Digi-Key; ComponentLink2URL: https://datasheet.ciiva.com/3916/96180008500114-crimp-terminals-3916636.pdf?src-supplier=Arrow; ComponentLink2Description: https://datasheet.ciiva.com/3916/96180008500114-crimp-terminals-3916636.pdf?src-supplier=Arrow
U6 = CMP-0095-00025-2: 8-bit AVR Microcontroller, 16KB Flash, 512 Bytes EEPROM, 1KB SRAM, 28-pin PDIP, Industrial Grade (-40°C to 85°C); Manufacturer: Microchip / Atmel; Frequency: 20MHz; Interface: I2C,SPI,UART,USART; Max Supply Voltage: 5.5V; Min Supply Voltage: 1.8V; Number of PWM Channels: 6; Number of Timers/Counters: 3; Number of I/Os: 23; Oscillator Type: Internal; Data Bus Width: 8b; Number of SPI Channels: 1; Watchdog Timer: Yes; Peripherals: Brown-out Detect/Reset,POR,PWM,WDT; ComponentLink1URL: http://www.atmel.com/; PackageReference: 28P3; ComponentLink1Description: Manufacturer URL; ComponentLink2URL: http://www.atmel.com/dyn/resources/prod_documents/8271.pdf; RevisionNote: DatasheetVersion updated. URLs added.; ComponentLink3URL: http://www.atmel.com/dyn/resources/prod_documents/8271S.pdf; ComponentLink3Description: ATmega48A/48PA/88A/88PA/168A/168PA/328/328P Summary; DatasheetVersion: revD, May-2011; PackageVersion: revB, Sep-2001; PackageDescription: 28-lead (0.300"/7.62mm Wide) Plastic Dual Inline Package (PDIP); ComponentLink2Description: ATmega48A/48PA/88A/88PA/168A/168PA/328/328P Datasheet; Supplier 1: Digi-Key; Manufacturer Part Number: ATMEGA168A-PU; Stock 1: 14167; Pricing 1: 1=2.19000, 25=2.00840, 100=1.81280 (USD); RoHS: Yes; Mount: Through Hole; Case/Package: PDIP; Number of Pins: 28; Contact Plating: Tin,Matte; Min Operating Temperature: -40°C; Max Operating Temperature: 85°C; Package Quantity: 14; Core Architecture: AVR; RAM Size: 1KB; Packaging: Rail/Tube; Number of ADC Channels: 6; Max Frequency: 20MHz; Number of I2C Channels: 1; Number of Programmable I/O: 23; Memory Type: FLASH; Memory Size: 16KB; Length: 34.8mm; Height: 4.572mm; Width: 7.49mm; Radiation Hardening: No; REACH SVHC: No SVHC; Lead Free: Lead Free; ComponentLink4URL: https://datasheet.ciiva.com/1157/1691443-1157401.pdf?src-supplier=Element14; ComponentLink4Description: https://datasheet.ciiva.com/1157/1691443-1157401.pdf?src-supplier=Element14
U7 = CMP-0186-00005-2: 8-Bit I/O Expander with Serial Interface, 18-Pin PDIP, Extended Temperature; Manufacturer: Microchip; Interface: I2C,Serial; Number of Bits: 8; Output Current: 25mA; Number of Channels: 1; Nominal Supply Current: 1mA; Min Supply Voltage: 4.5V; Max Supply Voltage: 5.5V; Power Dissipation: 700mW; Max Frequency: 1.7MHz; PackageVersion: revBB, Aug-2009; ComponentLink3Description: Package Specification; Code_JEDEC: MS-001; DatasheetVersion: revE, Aug-2007; ComponentLink1URL: http://www.microchip.com/; ComponentLink3URL: http://www.microchip.com/stellent/groups/techpub_sg/documents/packagingspec/en012702.pdf; ComponentLink2Description: Datasheet; RevisionNote: URLs added.; PackageDescription: 18-Lead Plastic Dual In-Line (P) - 300 mil Body [PDIP]; PackageReference: PDIP300-P18; ComponentLink1Description: Manufacturer URL; ComponentLink2URL: http://ww1.microchip.com/downloads/en/DeviceDoc/21919e.pdf; Supplier 1: Digi-Key; Manufacturer Part Number: MCP23008-E/P; Stock 1: 809; Pricing 1: 1=1.05000, 25=0.87560, 100=0.80340 (USD); RoHS: Yes; Mount: Through Hole; Case/Package: PDIP; Number of Pins: 18; Min Operating Temperature: -40°C; Max Operating Temperature: 125°C; Package Quantity: 25; Packaging: Rail/Tube; Number of I/Os: 8; Frequency: 1.7MHz; REACH SVHC: No SVHC; Lead Free: Lead Free; ComponentLink4URL: https://datasheet.ciiva.com/19457/2161094-19457129.pdf?src-supplier=Jameco; ComponentLink4Description: https://datasheet.ciiva.com/19457/2161094-19457129.pdf?src-supplier=Jameco; ComponentLink5URL: https://datasheet.ciiva.com/4826/21919b-65915-4826338.pdf?src-supplier=Mouser; ComponentLink5Description: https://datasheet.ciiva.com/4826/21919b-65915-4826338.pdf?src-supplier=Mouser; ComponentLink6URL: https://datasheet.ciiva.com/1780/21919e-1780549.pdf?src-supplier=Digi-Key; ComponentLink6Description: https://datasheet.ciiva.com/1780/21919e-1780549.pdf?src-supplier=Digi-Key; ComponentLink7URL: https://datasheet.ciiva.com/14621/70046134-14621757.pdf?src-supplier=Allied+Electronics; ComponentLink7Description: https://datasheet.ciiva.com/14621/70046134-14621757.pdf?src-supplier=Allied+Electronics; ComponentLink8URL: https://datasheet.ciiva.com/3149/21919e-3149151.pdf?src-supplier=Avnet; ComponentLink8Description: https://datasheet.ciiva.com/3149/21919e-3149151.pdf?src-supplier=Avnet; ComponentLink9URL: https://datasheet.ciiva.com/1495/12174-1495862.pdf?src-supplier=Element14; ComponentLink9Description: https://datasheet.ciiva.com/1495/12174-1495862.pdf?src-supplier=Element14
U8 U9 = CMP-0186-00081-2: 16-Bit I/O Expander with Serial Interface, 28-Pin SPDIP, Extended Temperature; Manufacturer: Microchip; Interface: I2C,Serial; Number of Channels: 1; Nominal Supply Current: 1mA; Min Supply Voltage: 1.8V; Max Supply Voltage: 5.5V; Number of I/Os: 16; Frequency: 1.7MHz; RevisionNote: URLs added.; ComponentLink3Description: Package Specification; PackageVersion: revBB, Aug-2009; ComponentLink1Description: Manufacturer URL; DatasheetVersion: revB, Feb-2007; PackageDescription: 28-Lead Skinny Plastic Dual In-Line (SP) - 300 mil Body [SPDIP]; ComponentLink1URL: http://www.microchip.com/; PackageReference: SPDIP300-SP28; ComponentLink3URL: http://www.microchip.com/stellent/groups/techpub_sg/documents/packagingspec/en012702.pdf; ComponentLink2Description: Datasheet; ComponentLink2URL: http://ww1.microchip.com/downloads/en/DeviceDoc/21952b.pdf; Supplier 1: Digi-Key; Manufacturer Part Number: MCP23017-E/SP; Stock 1: 2595; Pricing 1: 1=1.24000, 25=1.03000, 100=0.93730 (USD); RoHS: Yes; Mount: Through Hole,Surface Mount; Case/Package: DIP; Number of Pins: 28; Min Operating Temperature: -40°C; Max Operating Temperature: 125°C; Packaging: Rail/Tube; Max Frequency: 1.7MHz; Number of Bits: 16; REACH SVHC: No SVHC; Lead Free: Lead Free; ComponentLink4URL: https://datasheet.ciiva.com/1495/12179-1495877.pdf?src-supplier=Element14; ComponentLink4Description: https://datasheet.ciiva.com/1495/12179-1495877.pdf?src-supplier=Element14; ComponentLink5URL: https://datasheet.ciiva.com/3149/21952b-3149159.pdf?src-supplier=Avnet; ComponentLink5Description: https://datasheet.ciiva.com/3149/21952b-3149159.pdf?src-supplier=Avnet; ComponentLink6URL: https://datasheet.ciiva.com/16350/filehandler-aspxddocname-en023709-16350808.pdf?src-supplier=Future+Electronics; ComponentLink6Description: https://datasheet.ciiva.com/16350/filehandler-aspxddocname-en023709-16350808.pdf?src-supplier=Future+Electronics; ComponentLink7URL: https://datasheet.ciiva.com/18405/70046137-18405547.pdf?src-supplier=Allied+Electronics; ComponentLink7Description: https://datasheet.ciiva.com/18405/70046137-18405547.pdf?src-supplier=Allied+Electronics; ComponentLink8URL: https://datasheet.ciiva.com/1780/21952b-1780556.pdf?src-supplier=Digi-Key; ComponentLink8Description: https://datasheet.ciiva.com/1780/21952b-1780556.pdf?src-supplier=Digi-Key
X1 = ATS080B-E: CRYSTAL 8.0000MHZ 18PF T/H; Manufacturer: CTS; Frequency: 8MHz; Frequency Tolerance: 30ppm; ESR (Equivalent Series Resistance): 60R; Frequency Stability: 50ppm; Supplier 1: Digi-Key; Manufacturer Part Number: ATS080B-E; Stock 1: 29517; Pricing 1: 1=0.38000, 10=0.31500, 50=0.28360, 100=0.25200, 500=0.23940, 1000=0.20160, 2500=0.18900, 5000=0.18270, 10000=0.17640 (USD); RoHS: Yes; Mount: Through Hole; Number of Pins: 2; Contact Plating: Copper,Tin,Silver; Min Operating Temperature: -40°C; Max Operating Temperature: 85°C; Package Quantity: 100; Load Capacitance: 18pF; Packaging: Bulk; Tolerance: 30ppm; Termination: Radial; Length: 0.427inch; Height: 0.145inch; Width: 0.177inch; ComponentLink1URL: https://datasheet.ciiva.com/859/008-0309-0-859649.pdf?src-supplier=Digi-Key; ComponentLink1Description: https://datasheet.ciiva.com/859/008-0309-0-859649.pdf?src-supplier=Digi-Key; ComponentLink2URL: https://datasheet.ciiva.com/3176/008-0309-0-3176342.pdf?src-supplier=Avnet; ComponentLink2Description: https://datasheet.ciiva.com/3176/008-0309-0-3176342.pdf?src-supplier=Avnet; ComponentLink3URL: https://datasheet.ciiva.com/4945/008-0309-0-32667-4945355.pdf?src-supplier=Mouser; ComponentLink3Description: https://datasheet.ciiva.com/4945/008-0309-0-32667-4945355.pdf?src-supplier=Mouser

## Sheet sensor-3.SchDoc
size Letter
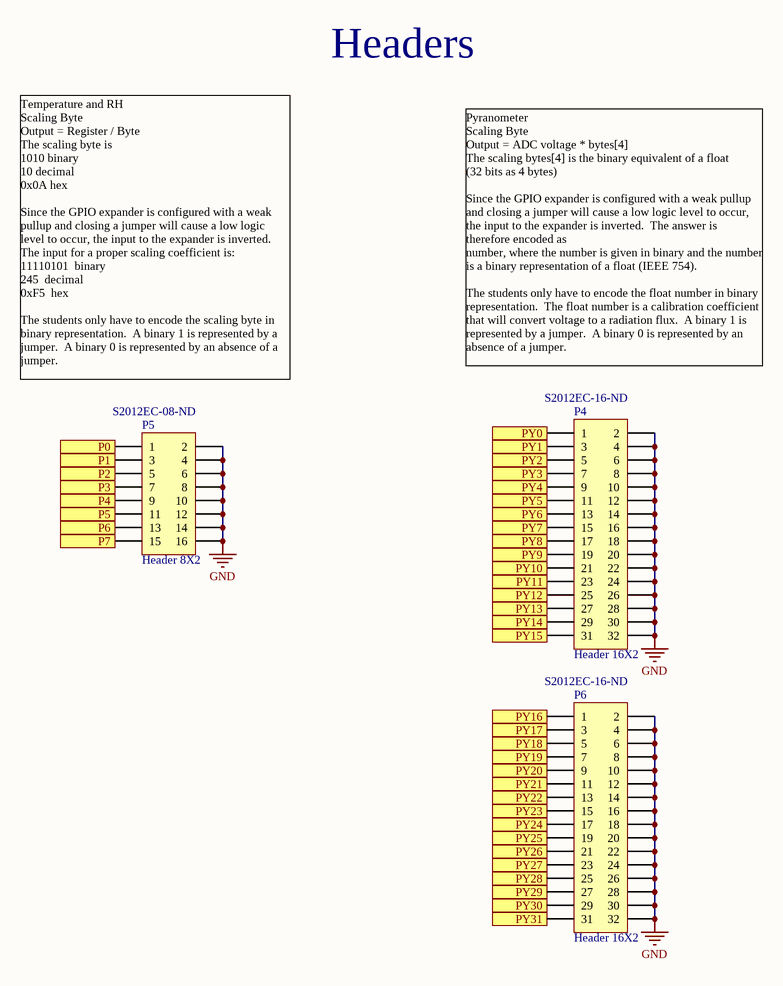
[diagram p2: sensor-3.SchDoc]

### Parts
P4  Header 16X2  Supplier Part Number 1: S2012EC-16-ND  [HDR2X16]
P5  Header 8X2  Supplier Part Number 1: S2012EC-08-ND  [HDR2X8]
P6  Header 16X2  Supplier Part Number 1: S2012EC-16-ND  [HDR2X16]

### Ports
P0, P1, P2, P3, P4, P5, P6, P7, PY0, PY1, PY2, PY3, PY4, PY5, PY6, PY7, PY8, PY9, PY10, PY11, PY12, PY13, PY14, PY15, PY16, PY17, PY18, PY19, PY20, PY21, PY22, PY23, PY24, PY25, PY26, PY27, PY28, PY29, PY30, PY31

### Nets
GND: P4.2 P4.4 P4.6 P4.8 P4.10 P4.12 P4.14 P4.16 P4.18 P4.20 P4.22 P4.24 P4.26 P4.28 P4.30 P4.32 P5.2 P5.4 P5.6 P5.8 P5.10 P5.12 P5.14 P5.16 P6.2 P6.4 P6.6 P6.8 P6.10 P6.12 P6.14 P6.16 P6.18 P6.20 P6.22 P6.24 P6.26 P6.28 P6.30 P6.32
NetP4_1: P4.1 ; port PY0
NetP4_3: P4.3 ; port PY1
NetP4_5: P4.5 ; port PY2
NetP4_7: P4.7 ; port PY3
NetP4_9: P4.9 ; port PY4
NetP4_11: P4.11 ; port PY5
NetP4_13: P4.13 ; port PY6
NetP4_15: P4.15 ; port PY7
NetP4_17: P4.17 ; port PY8
NetP4_19: P4.19 ; port PY9
NetP4_21: P4.21 ; port PY10
NetP4_23: P4.23 ; port PY11
NetP4_25: P4.25 ; port PY12
NetP4_27: P4.27 ; port PY13
NetP4_29: P4.29 ; port PY14
NetP4_31: P4.31 ; port PY15
NetP5_1: P5.1 ; port P0
NetP5_3: P5.3 ; port P1
NetP5_5: P5.5 ; port P2
NetP5_7: P5.7 ; port P3
NetP5_9: P5.9 ; port P4
NetP5_11: P5.11 ; port P5
NetP5_13: P5.13 ; port P6
NetP5_15: P5.15 ; port P7
NetP6_1: P6.1 ; port PY16
NetP6_3: P6.3 ; port PY17
NetP6_5: P6.5 ; port PY18
NetP6_7: P6.7 ; port PY19
NetP6_9: P6.9 ; port PY20
NetP6_11: P6.11 ; port PY21
NetP6_13: P6.13 ; port PY22
NetP6_15: P6.15 ; port PY23
NetP6_17: P6.17 ; port PY24
NetP6_19: P6.19 ; port PY25
NetP6_21: P6.21 ; port PY26
NetP6_23: P6.23 ; port PY27
NetP6_25: P6.25 ; port PY28
NetP6_27: P6.27 ; port PY29
NetP6_29: P6.29 ; port PY30
NetP6_31: P6.31 ; port PY31

### Notes on the sheet
- Headers
- Pyranometer
  Scaling Byte
  Output = ADC voltage * bytes[4]
  The scaling bytes[4] is the binary equivalent of a float
  (32 bits as 4 bytes)
  Since the GPIO expander is configured with a weak pullup and closing a jumper will cause a low logic level to occur, the input to the expander is inverted.  The answer is therefore encoded as
  number, where the number is given in binary and the number is a binary representation of a float (IEEE 754).
  The students only have to encode the float number in binary representation.  The float number is a calibration coefficient that will convert voltage to a radiation flux.  A binary 1 is represented by a jumper.  A binary 0 is represented by an absence of a jumper.
- Temperature and RH
  Scaling Byte
  Output = Register / Byte
  The scaling byte is
  1010	binary
  10	decimal
  0x0A	hex
  Since the GPIO expander is configured with a weak pullup and closing a jumper will cause a low logic level to occur, the input to the expander is inverted.  The input for a proper scaling coefficient is:
  11110101 	binary
  245 	decimal
  0xF5 	hex
  The students only have to encode the scaling byte in binary representation.  A binary 1 is represented by a jumper.  A binary 0 is represented by an absence of a jumper.

### Library data of the parts
P4 P6 = Header 16X2: Header, 16-Pin, Dual row; Manufacturer: Sullins; Manufacturer Part Number: PREC016DAAN-RC; Number of Positions: 32; Connector Type: Male Pin; Pitch: 0.1inch; LatestRevisionDate: 17-Jul-2002; LatestRevisionNote: Re-released for DXP Platform.; Publisher: Altium Limited; Supplier 1: Digi-Key; Stock 1: 264; Pricing 1: 1=0.61000, 10=0.57200, 25=0.51440, 50=0.45740, 100=0.43830, 250=0.40016, 500=0.38112 (USD); RoHS: Yes; Mount: Through Hole; Color: Black; Contact Plating: Tin; Package Quantity: 1; Number of Rows: 2; Packaging: Bulk; Termination: Solder; Row Spacing: 0.1inch; Contact Mating Length: 0.23inch; ComponentLink1URL: https://datasheet.ciiva.com/740/xrxczzzdxxn-rc-11636-b-740869.pdf?src-supplier=Digi-Key; ComponentLink1Description: https://datasheet.ciiva.com/740/xrxczzzdxxn-rc-11636-b-740869.pdf?src-supplier=Digi-Key
P5 = Header 8X2: Header, 8-Pin, Dual row; Manufacturer: Sullins; Manufacturer Part Number: PREC008DAAN-RC; Number of Positions: 16; Connector Type: Male Pin; Pitch: 0.1inch; LatestRevisionDate: 17-Jul-2002; LatestRevisionNote: Re-released for DXP Platform.; Publisher: Altium Limited; Supplier 1: Digi-Key; Stock 1: 1029; Pricing 1: 1=0.35000, 10=0.33300, 25=0.28600, 50=0.24300, 100=0.23340, 250=0.20960, 500=0.20008 (USD); RoHS: Yes; Mount: Through Hole; Color: Black; Contact Plating: Tin; Package Quantity: 1; Number of Rows: 2; Packaging: Bulk; Termination: Solder; Row Spacing: 0.1inch; Contact Mating Length: 0.23inch; ComponentLink1URL: https://datasheet.ciiva.com/740/xrxczzzdxxn-rc-11636-b-740877.pdf?src-supplier=Digi-Key; ComponentLink1Description: https://datasheet.ciiva.com/740/xrxczzzdxxn-rc-11636-b-740877.pdf?src-supplier=Digi-Key